# Altium schematic sheet DAC_Reference.SchDoc
size A4; DocumentNumber: 8; SheetNumber: 8; SheetTotal: 11
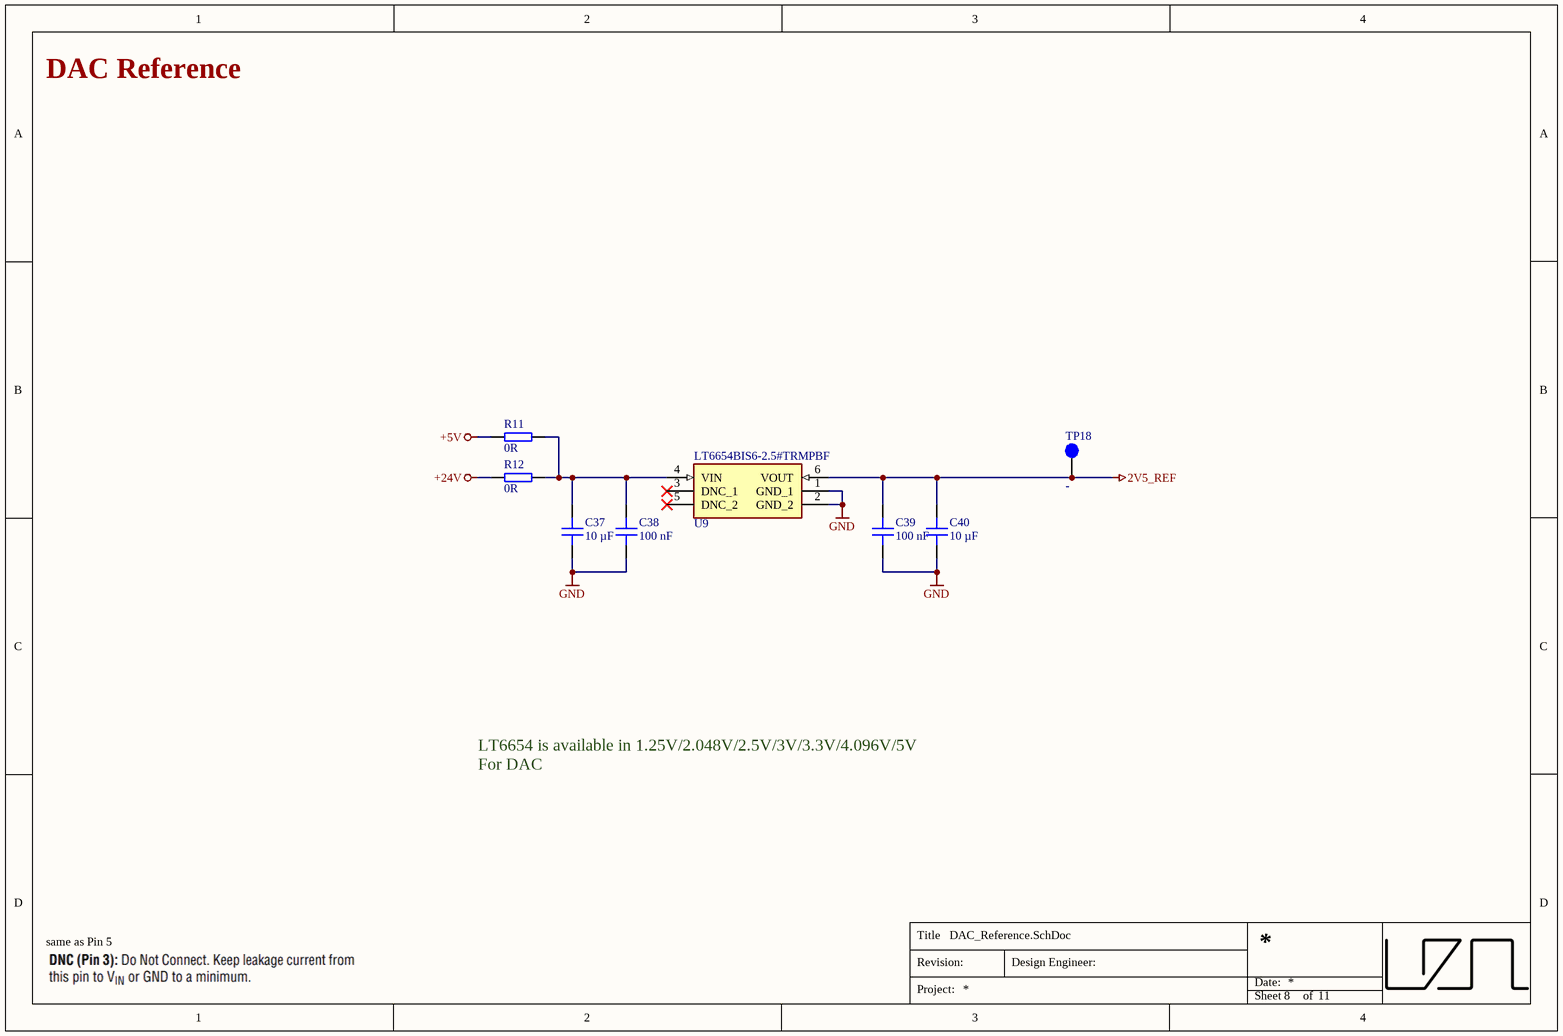
[diagram p0: DAC_Reference.SchDoc]

## Parts
C37  10 µF  [C_1206]
C38  100 nF  [C_0603]
C39  100 nF  [C_0603]
C40  10 µF  [C_1206]
R11  0R  [RES 0603_1608]
R12  0R  [RES 0603_1608]
TP18  -  [TP_1mm]
U9  LT6654BIS6-2.5#TRMPBF  [SOT95P280X100-6N]

## Nets
2V5_REF: C39.2 C40.2 TP18.1 U9.6(VOUT)
+5V: R11.1
+24V: R12.1
GND: C37.1 C38.1 C39.1 C40.1 U9.1(GND_1) U9.2(GND_2)
NetC37_2: C37.2 C38.2 R11.2 R12.2 U9.4(VIN)

Not connected (* = marked no-connect by the designer): U9 3(DNC_1)* 5(DNC_2)*

## Notes on the sheet
- DAC Reference
- LT6654 is available in 1.25V/2.048V/2.5V/3V/3.3V/4.096V/5V
  For DAC
- same as Pin 5
- Title
- Revision:
- Design Engineer:
- Date:
- Project:
- Sheet
- of

## Library data of the parts
C37 C40 = GRT31CR61H106KE01L: Capacitor 1206, 50 VDC, 10 µF, X5R; Manufacturer: Murata Electronics; Tolerance: 10 %; Voltage Rating: 50 VDC; Created from: MGremer; Manufacturer Part Number: GRT31CR61H106KE01L; PartID: 65; Created On: 20.12.2020 13:54:13; ComponentLink1Description: Datasheet; ComponentLink1URL: https://www.mouser.de/datasheet/2/281/1/GRT31CR61H106KE01_01-1989724.pdf; Component Type: Capacitor 1206; Device Package: 1206; Last Updated: 20.12.2020 16:34:30; Mounting Type: SMD; Operating Temperature: -55 - 85°C; Series: GRT; Supplier 1: Mouser; Supplier Part Number 1: 81-GRT31CR61H106KE1L; Type: Capacitor; Value: 10 µF; Live Cycle Status: 1; Stock number: Labor SMD Container
C38 C39 = C0603C104K9PACTU: Capacitor 0603, 6.3 VDC, 100 nF, X5R; Manufacturer: KEMET; Tolerance: 10 %; Voltage Rating: 6.3 VDC; Created from: MGremer; Manufacturer Part Number: C0603C104K9PACTU; PartID: 70; Created On: 20.12.2020 13:54:13; ComponentLink1Description: Datasheet; ComponentLink1URL: https://www.mouser.de/datasheet/2/212/KEM_C1006_X5R_SMD-1103249.pdf; Component Type: Capacitor 0603; Device Package: 0603; Last Updated: 20.01.2021 13:57:36; Mounting Type: SMD; Operating Temperature: -55 - 85°C; Series: SMD Comm X5R; Supplier 1: Mouser; Supplier Part Number 1: 80-C0603C104K9P; Type: Capacitor; Value: 100 nF; Live Cycle Status: 1; Stock number: not stored
R11 R12 = RC0603JR-070RL: SMD resistor E24 series; Manufacturer: YAGEO; Tolerance: 5%; Created from: MGremer; Manufacturer Part Number: RC0603JR-070RL; PartID: 1; Created On: 14.12.2020 16:17:14; ComponentLink1Description: Datasheet; ComponentLink1URL: https://www.mouser.de/datasheet/2/447/PYu-RC_Group_51_RoHS_L_10-1664068.pdf; Component Type: SMD resistor; Device Package: 0603; Last Updated: 04.03.2021 09:09:42; Mounting Type: SMD; Supplier 1: Mouser; Supplier Part Number 1: 603-RC0603JR-070RL; Supplier 2: LCSC; Supplier Part Number 2: C21189; Type: Resistor; Value: 0R; Live Cycle Status: 1; Stock number: Labor SMD Container; LCSC Part Number: C21189
TP18 = -: Test Point 1 mm; Value: TP; Created from: MGremer; Created: 2018_06_25_AGeiger; Manufacturer Part Number: -; PartID: 9; Created On: 02.03.2021 14:59:37; ComponentLink1Description: Datasheet; ComponentLink1URL: -; ComponentLink2Description: Homepage; ComponentLink2URL: -; Component Type: Test Point; Device Package: SMD; Last Updated: 03.11.2021 09:04:23; Manufacturer: -; Minimum Order: 1; Mounting Type: SMD; Supplier 1: -; Supplier Part Number 1: -; Type: Test point; Live Cycle Status: 1; Stock number: not stored
U9 = LT6654BIS6-2.5#TRMPBF: Precision Wide Supply High Output Drive Low Noise Reference; Manufacturer_Name: Analog Devices; Manufacturer_Part_Number: LT6654AHS6-5#TRMPBF; Created from: MHlatky; Datasheet Link: https://datasheet.datasheetarchive.com/originals/distributors/Datasheets_SAMA/831097393ba251ce33d430dddaea43ac.pdf; Height: 1mm; Manufacturer Part Number: LT6654BIS6-2.5#TRMPBF; PartID: 15; Created On: 03.03.2022 16:53:36; ComponentLink1Description: Datasheet; ComponentLink1URL: https://www.analog.com/media/en/technical-documentation/data-sheets/lt6654.pdf; Component Type: LT6654BIS6-2.5#TRMPBF; Last Updated: 04.04.2022 12:20:54; Manufacturer: Analog Devices; Mounting Type: SOT; Operating Temperature: -40 - 125; Supplier 1: Mouser; Supplier Part Number 1: 584-6654BIS625TRMPBF; Type: Voltage Reference; Live Cycle Status: 1